# EAGLE schematic skyshieldv2.1 (EAGLE 7.2.0)
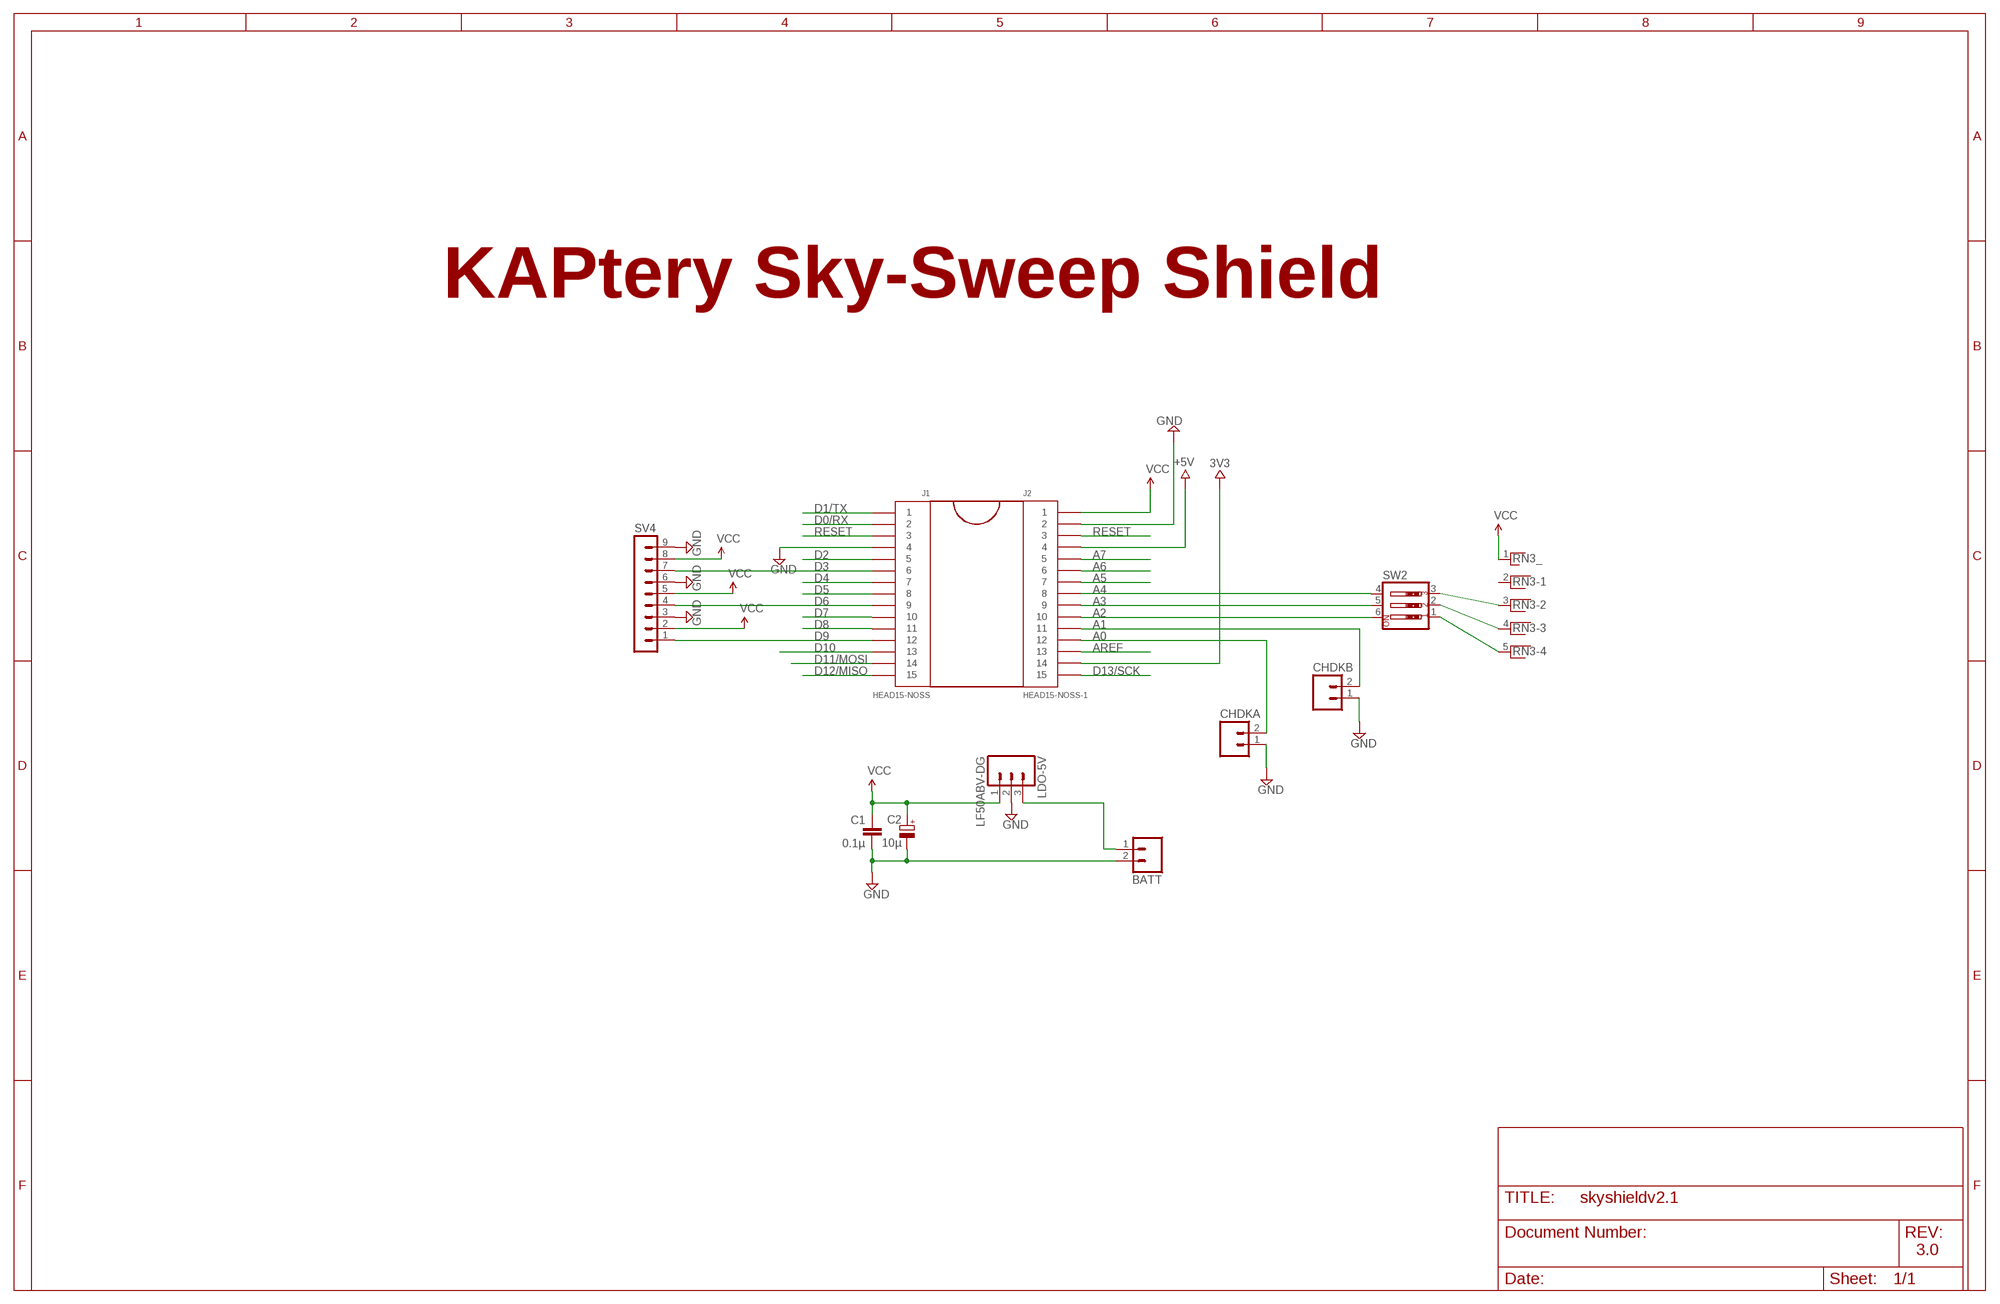
[diagram p0: schematic, sheet 1]

## Parts
BATT  M02PTH  [1X02]
C1  0.1µ  C-EU025-024X044  [C025-024X044]
C2  10µ  CPOL-EUE1.8-4  [E1,8-4]
CHDKA  M02PTH  [1X02]
CHDKB  M02PTH  [1X02]
J1  HEAD15-NOSS  [HEAD15-NOSS]
J2  HEAD15-NOSS-1  [HEAD15-NOSS-1]
LDO-5V  LF50ABV-DG  M03PTH  [1X03]
RN3  RNX4  [RN-5]
SV4  MA09-1  [MA09-1]
SW2  SW_DIP-3  [EDG-03]

## Nets
3V3: J2.14
+5V: J2.4
A0: CHDKA.2 J2.12
A1: CHDKB.2 J2.11
A2: J2.10 SW2.6
A3: J2.9 SW2.5
A4: J2.8 SW2.4
A5: J2.7
A6: J2.6
A7: J2.5
AREF: J2.13
D0/RX: J1.2
D1/TX: J1.1
D2: J1.5
D3: J1.6 SV4.7
D4: J1.7
D5: J1.8
D6: J1.9 SV4.4
D7: J1.10
D8: J1.11
D9: J1.12 SV4.1
D10: J1.13
D11/MOSI: J1.14
D12/MISO: J1.15
D13/SCK: J2.15
GND [power]: BATT.2 C1.2 C2.- CHDKA.1 CHDKB.1 J1.4 J2.2 LDO-5V.2 SV4.3 SV4.6 SV4.9
N$6: BATT.1 LDO-5V.3
N$7: RN3.3 SW2.3
N$8: RN3.4 SW2.2
N$9: RN3.5 SW2.1
RESET: J1.3 J2.3
VCC [power]: C1.1 C2.+ J2.1 LDO-5V.1 RN3.1 SV4.2 SV4.5 SV4.8
Unconnected: RN3.2

## Notes on the sheet
- KAPtery Sky-Sweep Shield
- 3.0

## Library data of the parts
BATT CHDKA CHDKB = SparkFun-Connectors:M02: Standard 2-pin 0.1" header. Use with - straight break away headers ( PRT-00116) - right angle break away headers (PRT-00553) - swiss pins (PRT-00743) - machine pins (PRT-00117) - female headers (PRT-00115) Molex polarized connector foot print use with: PRT-08233 with associated crimp pins and housings. 2.54_SCREWTERM for use with PRT-10571. 3.5mm Screw Terminal footprints for PRT-08084 5mm Screw Terminal footprints for use with PRT-08432
C1 = resistor:C-EU: CAPACITOR, European symbol
C2 = resistor:CPOL-EU: POLARIZED CAPACITOR, European symbol
J1 = MyCON2:HEAD15-NOSS
J2 = MyCON2:HEAD15-NOSS-1
LDO-5V = SparkFun-Connectors:M03: Header 3 Standard 3-pin 0.1" header. Use with straight break away headers (SKU : PRT-00116), right angle break away headers (PRT-00553), swiss pins (PRT-00743), machine pins (PRT-00117), and female headers (PRT-00115). Molex polarized connector foot print use with SKU : PRT-08232 with associated crimp pins and housings.
RN3 = resistor-net:RNX4: RESISTOR NETWORK; OC_FARNELL: unknown; OC_NEWARK: unknown
SV4 = con-lstb:MA09-1: PIN HEADER; OC_FARNELL: unknown; OC_NEWARK: unknown
SW2 = special:SW_DIP-3: DIP SWITCH

## Net classes
0 default: width 0.406 mm, clearance 0.203 mm
1 power: width 0.813 mm, clearance 0.203 mm